# EAGLE design sonda6 (EAGLE 4.16)
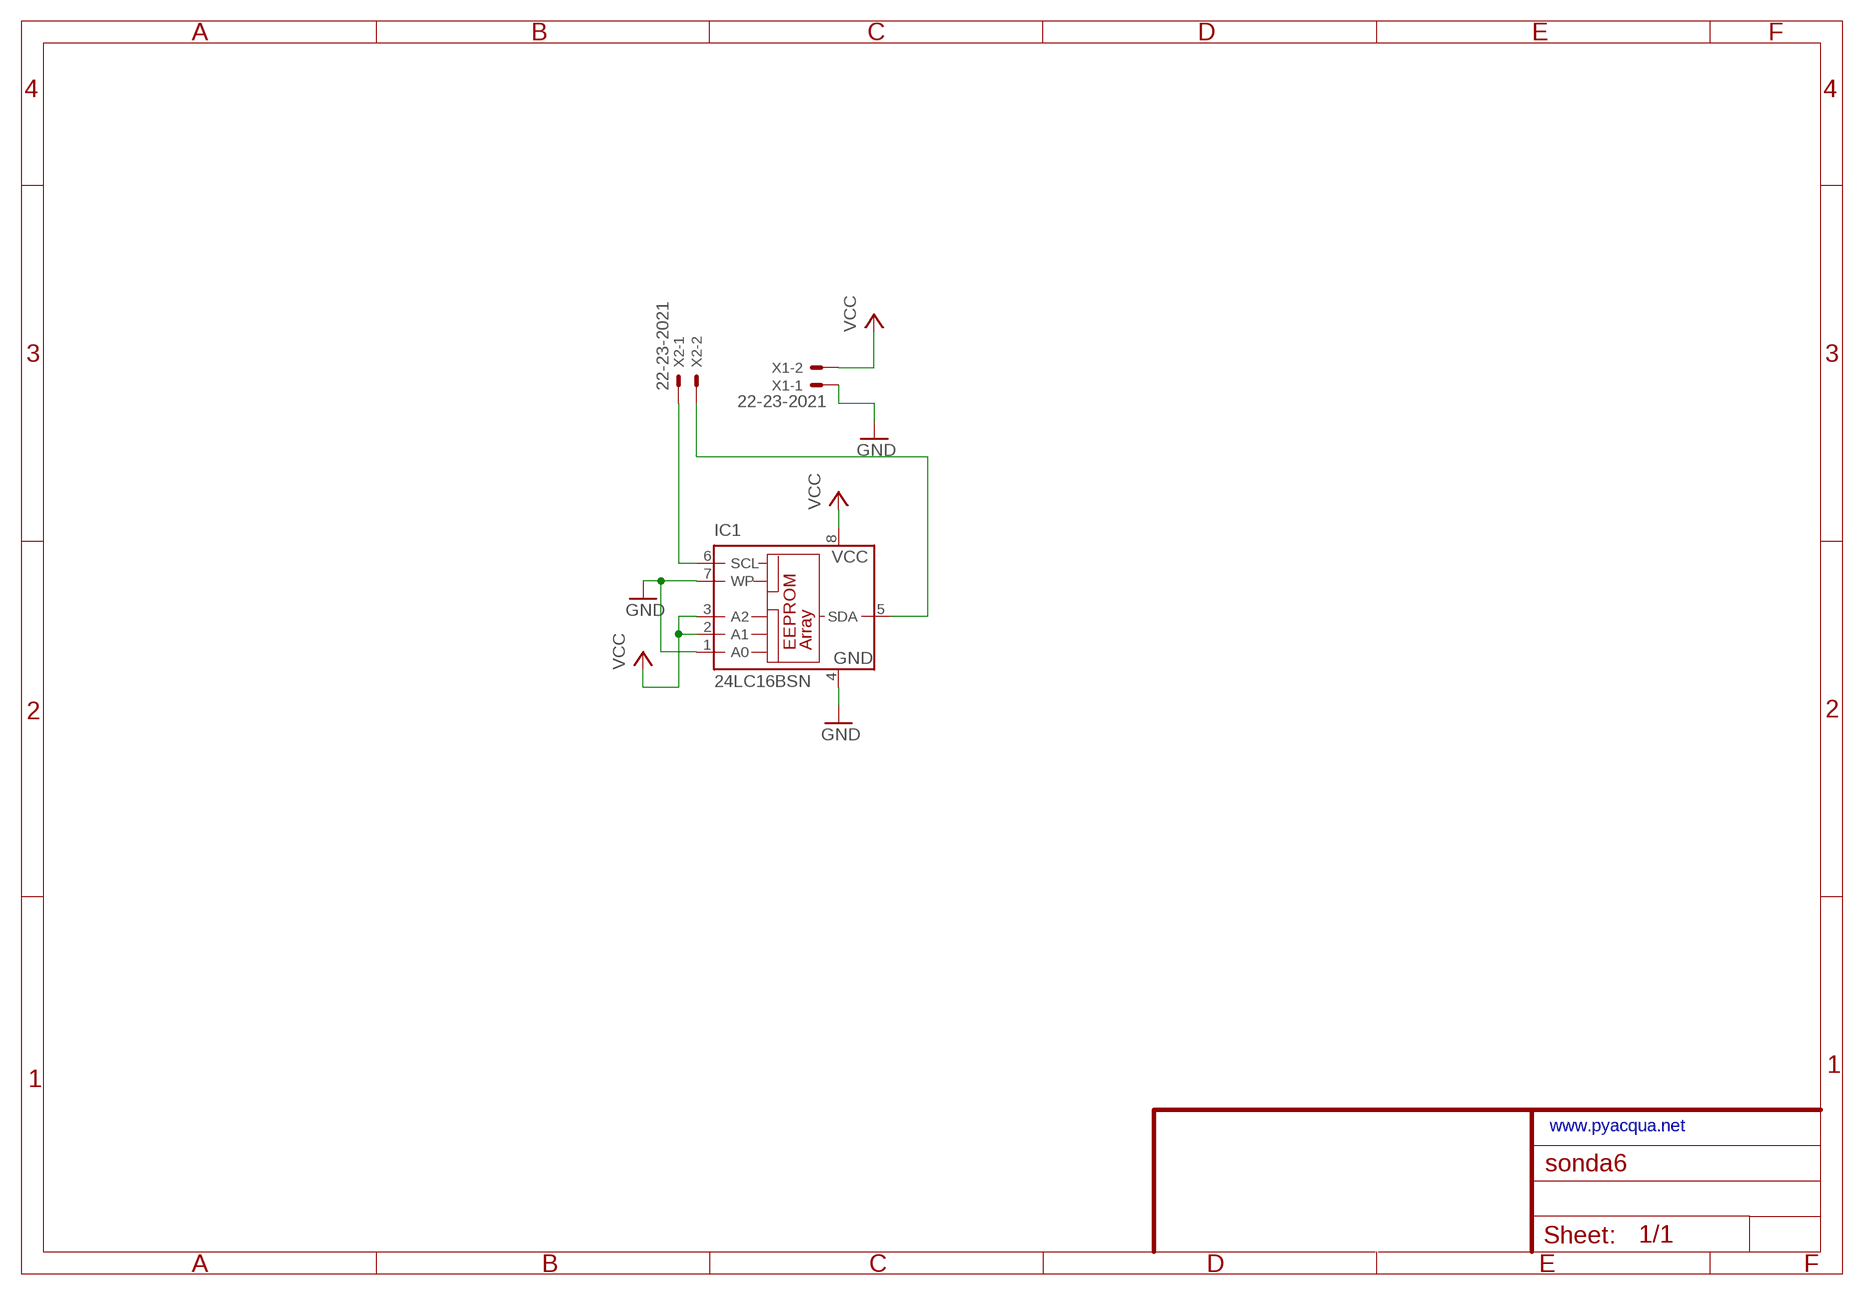
[diagram p0: schematic, sheet 1]

## Parts
IC1  24LC16BSN  [SO-08]
X1  22-23-2021  [22-23-2021]
X2  22-23-2021  [22-23-2021]

## Nets
GND: IC1.1(A0) IC1.4(GND) IC1.7(WP) X1.1
N$1: IC1.6(SCL) X2.1
N$2: IC1.5(SDA) X2.2
VCC: IC1.2(A1) IC1.3(A2) IC1.8(VCC) X1.2

## Notes on the sheet
- www.pyacqua.net

## Library data of the parts
IC1 = microchip:24*: Serial EEPROM I2C
X1 X2 = con-molex:22-23-2021: .100" (2.54mm) Center Header - 2 Pin

## Board
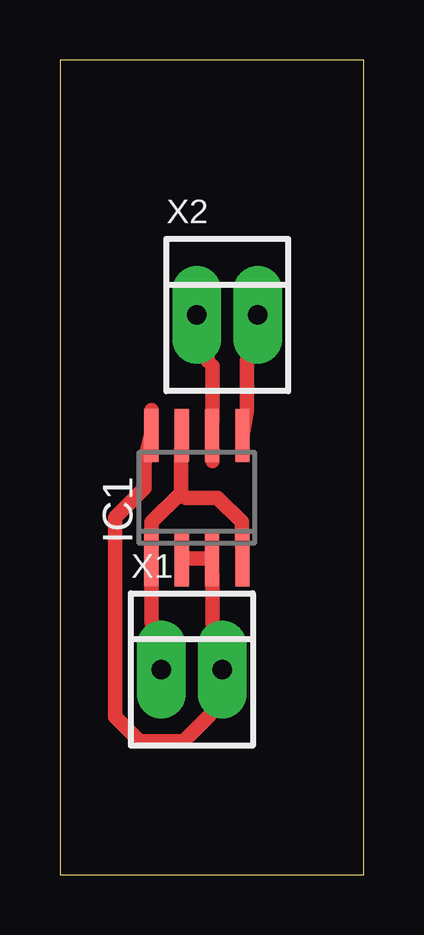
[diagram p1: board, top side]

Size 12.68 x 33.96 mm. Coordinates in mm from the lower left corner, seen from the top.
Outline: 0,0 12.68,0 12.68,33.96 0,33.96 0,0
Copper layers (1*16): Top 0.035mm / dielectric 1.5mm / Bottom 0.035mm
Design rules "mio2": minimum track width 24mil, minimum drill 24mil, track to track 24mil, track to pad 24mil, pad to pad 24mil, via to via 24mil, smd to smd 24mil, copper to edge 40mil, drill to drill 8mil, minimum pad ring 24mil, minimum via ring 24mil, stop-mask expansion 4mil, vias tented up to drill 0mil, thermal gap 10mil

### Footprints (pad centres in the part's own frame; a part is rotated, then mirrored left to right if it is on the bottom)
SO-08 = smd 0.6 x 2.2: 1 -1.905,-2.6; 2 -0.635,-2.6; 3 0.635,-2.6; 4 1.905,-2.6; 5 1.905,2.6; 6 0.635,2.6; 7 -0.635,2.6; 8 -1.905,2.6
22-23-2021 = drill 0.813 long: 1 -1.27,0; 2 1.27,0

### Placement (x,y rotation side)
IC1  5.71,15.71 0 top
U$1  [A4P-LOC]  -78.11,-113.83 0 top  (outside the outline)
X1  5.51,8.55 0 top
X2  6.98,23.33 0 top

### Tracks (layer width: path | path; a pad name or v marks a point on that pad's centre or on a via)
GND
  Top 0.61: X1.1 3.83,10.53 3.83,12.05 IC1.1 3.83,14.19 3.83,14.69 5.05,15.91 | 5.05,15.91 5.05,17.23 IC1.7 | IC1.4 7.59,14.19 7.59,14.69 6.57,15.71 5.25,15.71 5.05,15.91
N$1
  Top 0.61: 6.37,17.23 IC1.6 6.37,19.37 6.37,21.2 6.17,21.4 X2.1
N$2
  Top 0.61: IC1.5 7.79,19.37 7.79,21.4 X2.2
VCC
  Top 0.61: IC1.2 5.35,13.17 6.07,13.17 IC1.3 6.37,12.05 6.37,10.53 X1.2 6.27,6.67 5.15,5.55 3.32,5.55 2.31,6.57 2.31,14.9 3.53,16.12 3.53,17.23 IC1.8 3.83,19.37